# EAGLE schematic roboCup-NUCLEO-PACK (EAGLE 9.1.3)

## Sheet 1 of 3
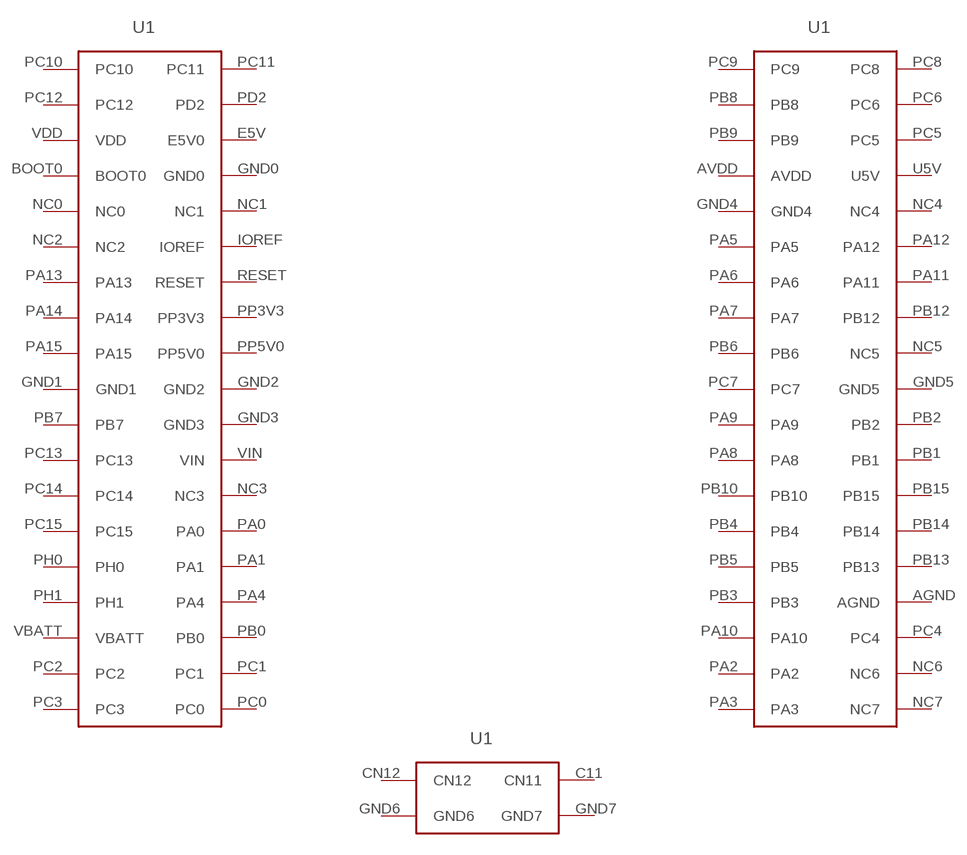
[diagram p0: schematic, sheet 1]

### Parts
U1  NUCLEO-STM32F446RE  [NUCLEO-STM32F446RE]
Unconnected: U1.AGND U1.AVDD U1.BOOT0 U1.C11(CN11) U1.CN12 U1.E5V(E5V0) U1.GND0 U1.GND1 U1.GND2 U1.GND3 U1.GND4 U1.GND5 U1.GND6 U1.GND7 U1.IOREF U1.NC0 U1.NC1 U1.NC2 U1.NC3 U1.NC4 U1.NC5 U1.NC6 U1.NC7 U1.PA0 U1.PA1 U1.PA2 U1.PA3 U1.PA4 U1.PA5 U1.PA6 U1.PA7 U1.PA8 U1.PA9 U1.PA10 U1.PA11 U1.PA12 U1.PA13 U1.PA14 U1.PA15 U1.PB0 U1.PB1 U1.PB2 U1.PB3 U1.PB4 U1.PB5 U1.PB6 U1.PB7 U1.PB8 U1.PB9 U1.PB10 U1.PB12 U1.PB13 U1.PB14 U1.PB15 U1.PC0 U1.PC1 U1.PC2 U1.PC3 U1.PC4 U1.PC5 U1.PC6 U1.PC7 U1.PC8 U1.PC9 U1.PC10 U1.PC11 U1.PC12 U1.PC13 U1.PC14 U1.PC15 U1.PD2 U1.PH0 U1.PH1 U1.PP3V3 U1.PP5V0 U1.RESET U1.U5V U1.VBATT U1.VDD U1.VIN

## Sheet 2 of 3
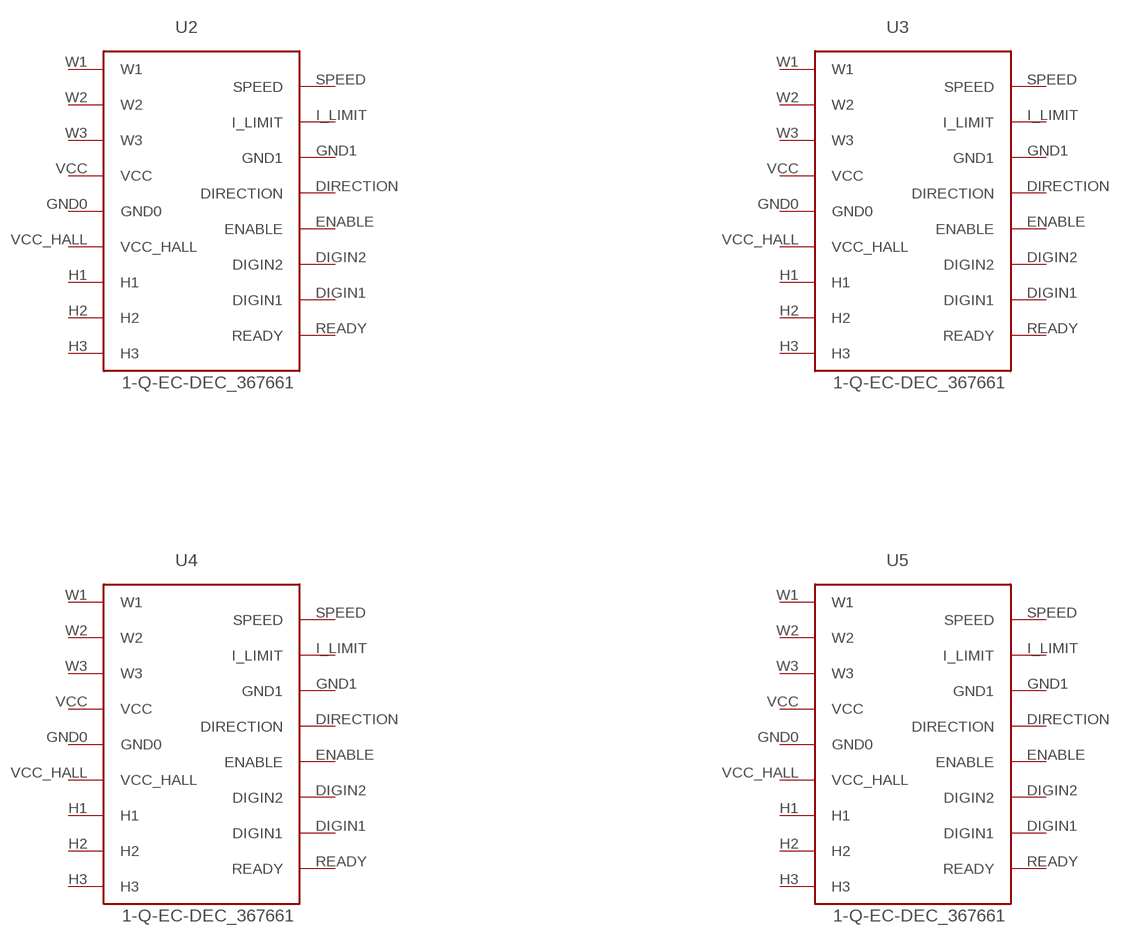
[diagram p1: schematic, sheet 2]

### Parts
U2  1-Q-EC-DEC_367661  [1-Q-EC-DEC_367661]
U3  1-Q-EC-DEC_367661  [1-Q-EC-DEC_367661]
U4  1-Q-EC-DEC_367661  [1-Q-EC-DEC_367661]
U5  1-Q-EC-DEC_367661  [1-Q-EC-DEC_367661]
Unconnected: U2.DIGIN1 U2.DIGIN2 U2.DIRECTION U2.ENABLE U2.GND0 U2.GND1 U2.H1 U2.H2 U2.H3 U2.I_LIMIT U2.READY U2.SPEED U2.VCC U2.VCC_HALL U2.W1 U2.W2 U2.W3 U3.DIGIN1 U3.DIGIN2 U3.DIRECTION U3.ENABLE U3.GND0 U3.GND1 U3.H1 U3.H2 U3.H3 U3.I_LIMIT U3.READY U3.SPEED U3.VCC U3.VCC_HALL U3.W1 U3.W2 U3.W3 U4.DIGIN1 U4.DIGIN2 U4.DIRECTION U4.ENABLE U4.GND0 U4.GND1 U4.H1 U4.H2 U4.H3 U4.I_LIMIT U4.READY U4.SPEED U4.VCC U4.VCC_HALL U4.W1 U4.W2 U4.W3 U5.DIGIN1 U5.DIGIN2 U5.DIRECTION U5.ENABLE U5.GND0 U5.GND1 U5.H1 U5.H2 U5.H3 U5.I_LIMIT U5.READY U5.SPEED U5.VCC U5.VCC_HALL U5.W1 U5.W2 U5.W3

## Sheet 3 of 3

## Library data of the parts
U1 = roboCup:NUCLEO-STM32F446RE: NUCLEO-STM32F446RE Development Board https://www.st.com/en/evaluation-tools/nucleo-f446re.html#sw-tools-scroll
U2-U5 = roboCup:1-Q-EC-DEC_367661: 1-Q-EC-DEC_367661 Maxon Motor Controller https://www.maxonmotorusa.com/maxon/view/catalog?etcc_med=ID+Teaser&etcc_cmp=ID-Teaser-Homepage-Drivesystem&etcc_cu=onsite&etcc_var=%5bus%5d%23en%23_d_&etcc_plc=home